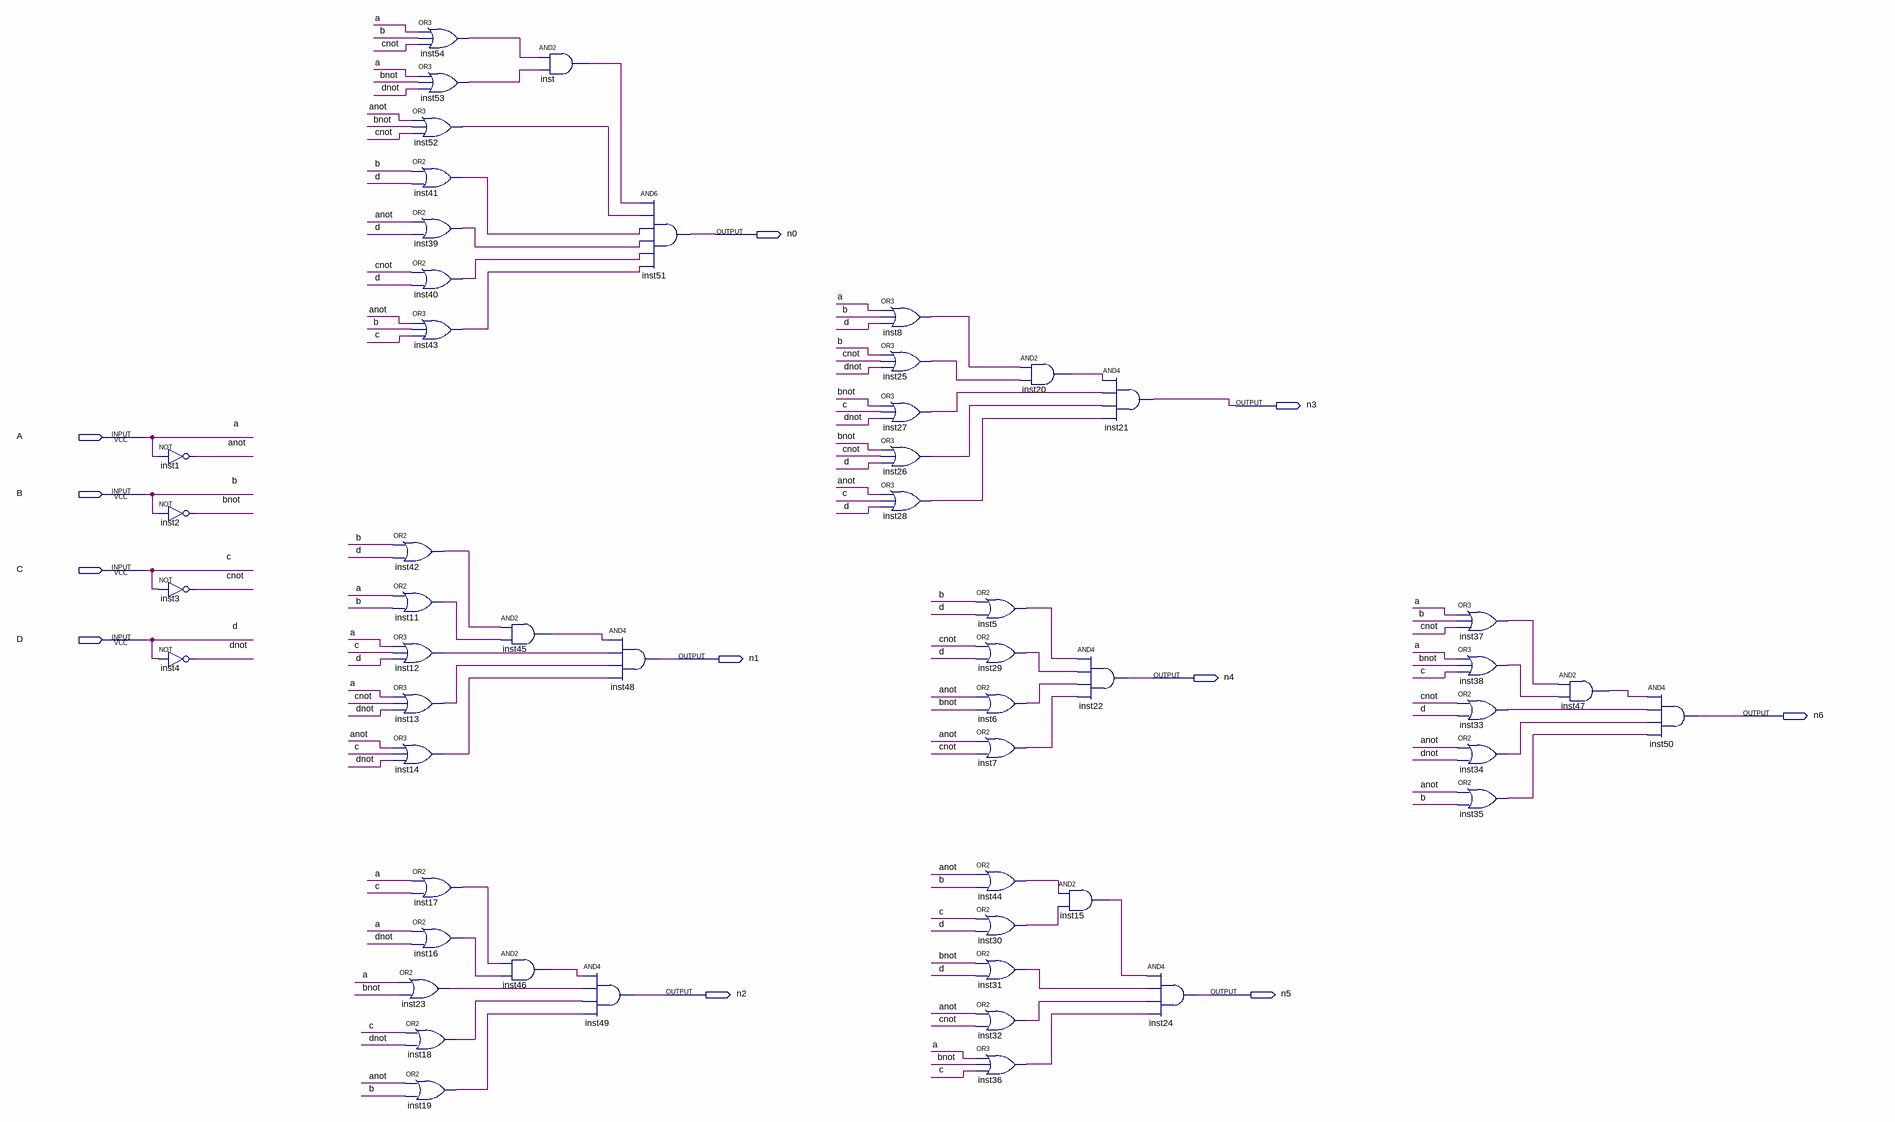
[diagram p0: schematic sheet]
// Quartus schematic SegmentsSchematic.bdf as structural Verilog: 53 symbols, 11 pins
module SegmentsSchematic (
  input  A,
  input  B,
  input  C,
  input  D,
  output n0,
  output n3,
  output n1,
  output n4,
  output n6,
  output n2,
  output n5
);

  wire anot, bnot, cnot, dnot, inst5_out, inst6_out, inst7_out, inst8_out, inst11_out, inst12_out,
       inst13_out, inst14_out, inst15_out, inst16_out, inst17_out, inst18_out, inst19_out, inst20_out,
       inst23_out, inst25_out, inst26_out, inst27_out, inst28_out, inst29_out, inst30_out, inst31_out,
       inst32_out, inst33_out, inst34_out, inst35_out, inst36_out, inst37_out, inst38_out, inst39_out,
       inst40_out, inst41_out, inst42_out, inst43_out, inst44_out, inst45_out, inst46_out, inst47_out,
       inst52_out, inst53_out, inst54_out, inst_out;

  not inst1 (anot, A);
  not inst2 (bnot, B);
  not inst3 (cnot, C);
  not inst4 (dnot, D);
  or inst54 (inst54_out, A, B, cnot);
  or inst53 (inst53_out, A, bnot, dnot);
  or inst52 (inst52_out, anot, bnot, cnot);
  or inst41 (inst41_out, B, D);
  or inst39 (inst39_out, anot, D);
  or inst40 (inst40_out, cnot, D);
  or inst43 (inst43_out, anot, B, C);
  or inst42 (inst42_out, B, D);
  or inst11 (inst11_out, A, B);
  or inst12 (inst12_out, A, C, D);
  or inst13 (inst13_out, A, cnot, dnot);
  or inst14 (inst14_out, anot, C, dnot);
  or inst17 (inst17_out, A, C);
  or inst16 (inst16_out, A, dnot);
  or inst23 (inst23_out, A, bnot);
  or inst18 (inst18_out, C, dnot);
  or inst19 (inst19_out, anot, B);
  and inst45 (inst45_out, inst42_out, inst11_out);
  and inst46 (inst46_out, inst17_out, inst16_out);
  and inst (inst_out, inst54_out, inst53_out);
  and inst49 (n2, inst46_out, inst23_out, inst18_out, inst19_out);
  and inst48 (n1, inst45_out, inst12_out, inst13_out, inst14_out);
  and inst51 (n0, inst_out, inst52_out, inst41_out, inst39_out, inst40_out, inst43_out);
  or inst8 (inst8_out, A, B, D);
  or inst25 (inst25_out, B, cnot, dnot);
  or inst27 (inst27_out, bnot, C, dnot);
  or inst26 (inst26_out, bnot, cnot, D);
  or inst28 (inst28_out, anot, C, D);
  or inst5 (inst5_out, B, D);
  or inst29 (inst29_out, cnot, D);
  or inst6 (inst6_out, anot, bnot);
  or inst7 (inst7_out, anot, cnot);
  or inst44 (inst44_out, anot, B);
  or inst30 (inst30_out, C, D);
  or inst31 (inst31_out, bnot, D);
  or inst32 (inst32_out, anot, cnot);
  or inst36 (inst36_out, A, bnot, C);
  and inst20 (inst20_out, inst8_out, inst25_out);
  and inst22 (n4, inst5_out, inst29_out, inst6_out, inst7_out);
  and inst15 (inst15_out, inst44_out, inst30_out);
  and inst21 (n3, inst20_out, inst27_out, inst26_out, inst28_out);
  and inst24 (n5, inst15_out, inst31_out, inst32_out, inst36_out);
  or inst37 (inst37_out, A, B, cnot);
  or inst38 (inst38_out, A, bnot, C);
  or inst33 (inst33_out, cnot, D);
  or inst34 (inst34_out, anot, dnot);
  or inst35 (inst35_out, anot, B);
  and inst47 (inst47_out, inst37_out, inst38_out);
  and inst50 (n6, inst47_out, inst33_out, inst34_out, inst35_out);
endmodule
